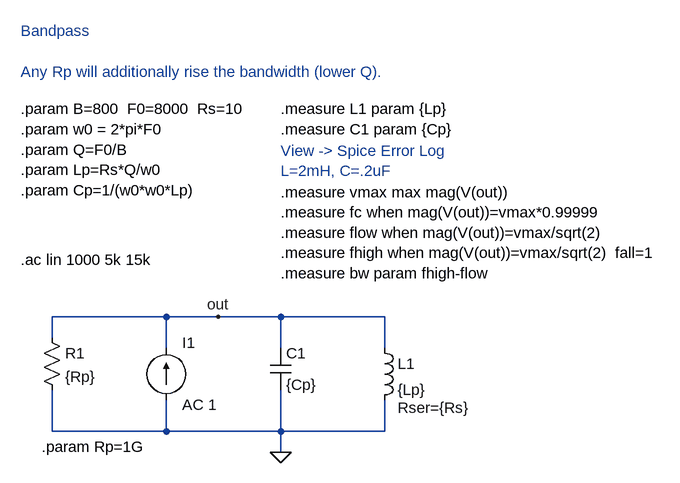
[diagram p0: schematic Bandpass1.asc]
Bandpass1.asc, the LTspice schematic file:
Version 4
SHEET 1 1128 680
WIRE 64 352 64 320
WIRE 64 496 64 432
WIRE 240 320 64 320
WIRE 240 368 240 320
WIRE 240 496 64 496
WIRE 240 496 240 448
WIRE 320 320 240 320
WIRE 416 320 320 320
WIRE 416 368 416 320
WIRE 416 496 240 496
WIRE 416 496 416 432
WIRE 416 528 416 496
WIRE 576 320 416 320
WIRE 576 368 576 320
WIRE 576 496 416 496
WIRE 576 496 576 448
FLAG 416 528 0
FLAG 320 320 out
SYMBOL cap 400 368 R0
SYMATTR InstName C1
SYMATTR Value {Cp}
SYMBOL ind 560 352 R0
WINDOW 39 36 108 Left 0
SYMATTR InstName L1
SYMATTR Value {Lp}
SYMATTR SpiceLine Rser={Rs}
SYMBOL current 240 448 M180
WINDOW 0 24 88 Left 0
WINDOW 3 24 0 Left 0
WINDOW 123 24 -7 Left 0
WINDOW 39 0 0 Left 0
SYMATTR InstName I1
SYMATTR Value ""
SYMATTR Value2 AC 1
SYMBOL res 48 336 R0
SYMATTR InstName R1
SYMATTR Value {Rp}
TEXT 16 0 Left 0 !.param B=800  F0=8000  Rs=10\n.param w0 = 2*pi*F0\n.param Q=F0/B\n.param Lp=Rs*Q/w0\n.param Cp=1/(w0*w0*Lp)
TEXT 16 232 Left 0 !.ac lin 1000 5k 15k
TEXT 416 0 Left 0 !.measure L1 param {Lp}\n.measure C1 param {Cp}
TEXT 416 64 Left 0 ;View -> Spice Error Log \nL=2mH, C=.2uF
TEXT 16 -120 Left 0 ;Bandpass\n \nAny Rp will additionally rise the bandwidth (lower Q).
TEXT 48 520 Left 0 !.param Rp=1G
TEXT 416 128 Left 0 !.measure vmax max mag(V(out))\n.measure fc when mag(V(out))=vmax*0.99999\n.measure flow when mag(V(out))=vmax/sqrt(2)\n.measure fhigh when mag(V(out))=vmax/sqrt(2)  fall=1\n.measure bw param fhigh-flow

The netlist it stands for:
* Bandpass1.asc
C1 out 0 {Cp}
L1 out 0 {Lp} Rser={Rs}
I1 0 out AC 1
R1 out 0 {Rp}
.param B=800  F0=8000  Rs=10
.param w0 = 2*pi*F0
.param Q=F0/B
.param Lp=Rs*Q/w0
.param Cp=1/(w0*w0*Lp)
.ac lin 1000 5k 15k
.measure L1 param {Lp}
.measure C1 param {Cp}
* View -> Spice Error Log
* L=2mH, C=.2uF
* Bandpass
* Any Rp will additionally rise the bandwidth (lower Q).
.param Rp=1G
.measure vmax max mag(V(out))
.measure fc when mag(V(out))=vmax*0.99999
.measure flow when mag(V(out))=vmax/sqrt(2)
.measure fhigh when mag(V(out))=vmax/sqrt(2)  fall=1
.measure bw param fhigh-flow
.backanno
.end